# Altium schematic sheet 51版_2020-06-08_13-22-36.schdoc
size 284 x 138 mm
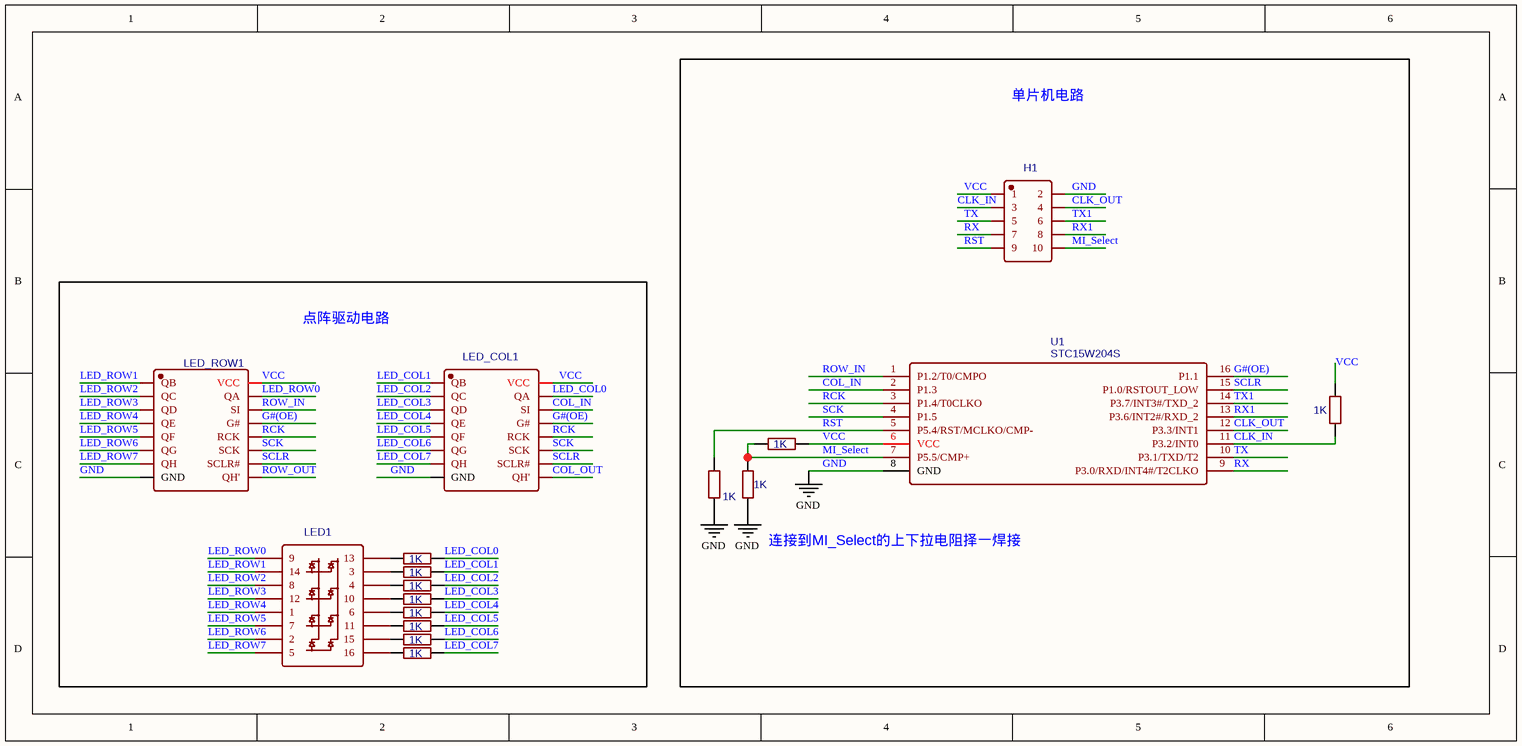
[diagram p0: 51版_2020-06-08_13-22-36.schdoc]

## Parts
H1  Female header2.54mm2*5p Straight  [HDR-TH_10P-P2.54-V-R2-C5-S2.54]  (value not drawn)
LED1  SLD1388DRA1GD  [SLD1388DRA1GD]  (value not drawn)
LED_COL1  74HC595D_C431479  [SOIC-16_L9.9-W3.9-P1.27-LS6.0-BL]  (value not drawn)
LED_ROW1  74HC595D_C431479  [SOIC-16_L9.9-W3.9-P1.27-LS6.0-BL]  (value not drawn)
R1  1K  [R0603]
R2  1K  [R0603]
R3  1K  [R0603]
R4  1K  [R0603]
R5  1K  [R0603]
R6  1K  [R0603]
R7  1K  [R0603]
R8  1K  [R0603]
R9  1K  [R0603]
R10  1K  [R0603]
R11  1K  [R0603]
R12  1K  [R0603]
U1  STC15W204S  [SOIC-16_L9.9-W3.9-P1.27-LS6.0-BL]

## Blocks framed on the sheet
点阵驱动电路: LED1 LED_COL1 LED_ROW1 R1-R8

## Nets
GND: H1.2 LED_COL1.8(GND) LED_ROW1.8(GND) R9.1 R10.1 U1.8(GND)
CLK_IN: H1.3 R12.1 U1.11(P3.2/INT0)
CLK_OUT: H1.4 U1.12(P3.3/INT1)
COL_IN: LED_COL1.14(SI) U1.2(P1.3)
COL_OUT: LED_COL1.9(QH')
G#(OE): LED_COL1.13(G#) LED_ROW1.13(G#) U1.16(P1.1)
LED_COL0: LED_COL1.15(QA) R2.2
LED_COL1: LED_COL1.1(QB) R1.2
LED_COL2: LED_COL1.2(QC) R3.2
LED_COL3: LED_COL1.3(QD) R4.2
LED_COL4: LED_COL1.4(QE) R5.2
LED_COL5: LED_COL1.5(QF) R6.2
LED_COL6: LED_COL1.6(QG) R7.2
LED_COL7: LED_COL1.7(QH) R8.2
LED_ROW0: LED1.9 LED_ROW1.15(QA)
LED_ROW1: LED1.14 LED_ROW1.1(QB)
LED_ROW2: LED1.8 LED_ROW1.2(QC)
LED_ROW3: LED1.12 LED_ROW1.3(QD)
LED_ROW4: LED1.1 LED_ROW1.4(QE)
LED_ROW5: LED1.7 LED_ROW1.5(QF)
LED_ROW6: LED1.2 LED_ROW1.6(QG)
LED_ROW7: LED1.5 LED_ROW1.7(QH)
MI_Select: H1.10 R10.2 R11.2 U1.7(P5.5/CMP+)
RCK: LED_COL1.12(RCK) LED_ROW1.12(RCK) U1.3(P1.4/T0CLKO)
ROW_IN: LED_ROW1.14(SI) U1.1(P1.2/T0/CMPO)
ROW_OUT: LED_ROW1.9(QH')
RST: H1.9 R9.2 U1.5(P5.4/RST/MCLKO/CMP-)
RX: H1.7 U1.9(P3.0/RXD/INT4#/T2CLKO)
RX1: H1.8 U1.13(P3.6/INT2#/RXD_2)
SCK: LED_COL1.11(SCK) LED_ROW1.11(SCK) U1.4(P1.5)
SCLR: LED_COL1.10(SCLR#) LED_ROW1.10(SCLR#) U1.15(P1.0/RSTOUT_LOW)
TX: H1.5 U1.10(P3.1/TXD/T2)
TX1: H1.6 U1.14(P3.7/INT3#/TXD_2)
VCC: H1.1 LED_COL1.16(VCC) LED_ROW1.16(VCC) R11.1 R12.2 U1.6(VCC)
NetLED1_3: LED1.3 R1.1
NetLED1_4: LED1.4 R3.1
NetLED1_6: LED1.6 R5.1
NetLED1_10: LED1.10 R4.1
NetLED1_11: LED1.11 R6.1
NetLED1_13: LED1.13 R2.1
NetLED1_15: LED1.15 R7.1
NetLED1_16: LED1.16 R8.1

## Notes on the sheet
- 单片机电路
- 连接到MI_Select的上下拉电阻择一焊接

## Library data of the parts
H1 = Female header2.54mm2*5p Straight: BOM_Manufacturer: ReliaPro; Package Display: No; BOM_Supplier Part: C30419; BOM_Supplier: LCSC; BOM_Manufacturer Part: Female header2.54mm2*5p Straight; image: http://image.lceda.cn/szlcsc/C30419.jpg; spicePre: H; spiceSymbolName: Female header2.54mm2*5p Straight
LED1 = SLD1388DRA1GD: BOM_Manufacturer: SUNLIGHT; Contributor: LCSC; Package Display: No; BOM_Supplier: LCSC; BOM_Supplier Part: C225991; BOM_Manufacturer Part: SLD1388DRA1GD; spicePre: L; spiceSymbolName: SLD1388DRA1GD
LED_COL1 LED_ROW1 = 74HC595D_C431479: BOM_Manufacturer: TOSHIBA; Contributor: LCSC; SMT Type: Extend; Package Display: No; BOM_Supplier: LCSC; BOM_Supplier Part: C431479; BOM_Manufacturer Part: 74HC595D; BOM_LCSC Assembly: Yes; spicePre: U; spiceSymbolName: 74HC595D_C431479
R1-R12 = 1K: BOM_Manufacturer: UniOhm; BOM_Manufacturer Part: 0603WAF1001T5E; nameAlias: Resistance (Ohms); SMT Type: Basic; Package Display: No; BOM_Supplier: LCSC; BOM_LCSC Assembly: Yes; BOM_Supplier Part: C21190; spicePre: R; spiceSymbolName: 0603WAF1001T5E
U1 = STC15W204S: BOM_Manufacturer: STC Micro; Contributor: LCSC; SMT Type: Extend; BOM_Supplier: LCSC; BOM_Supplier Part: C20068; BOM_Manufacturer Part: STC15W204S; BOM_LCSC Assembly: Yes; spicePre: U; spiceSymbolName: STC15W204S